# Altium schematic sheet EMP_FC_Main.SchDoc
size A4; SheetNumber: 1; SheetTotal: 5
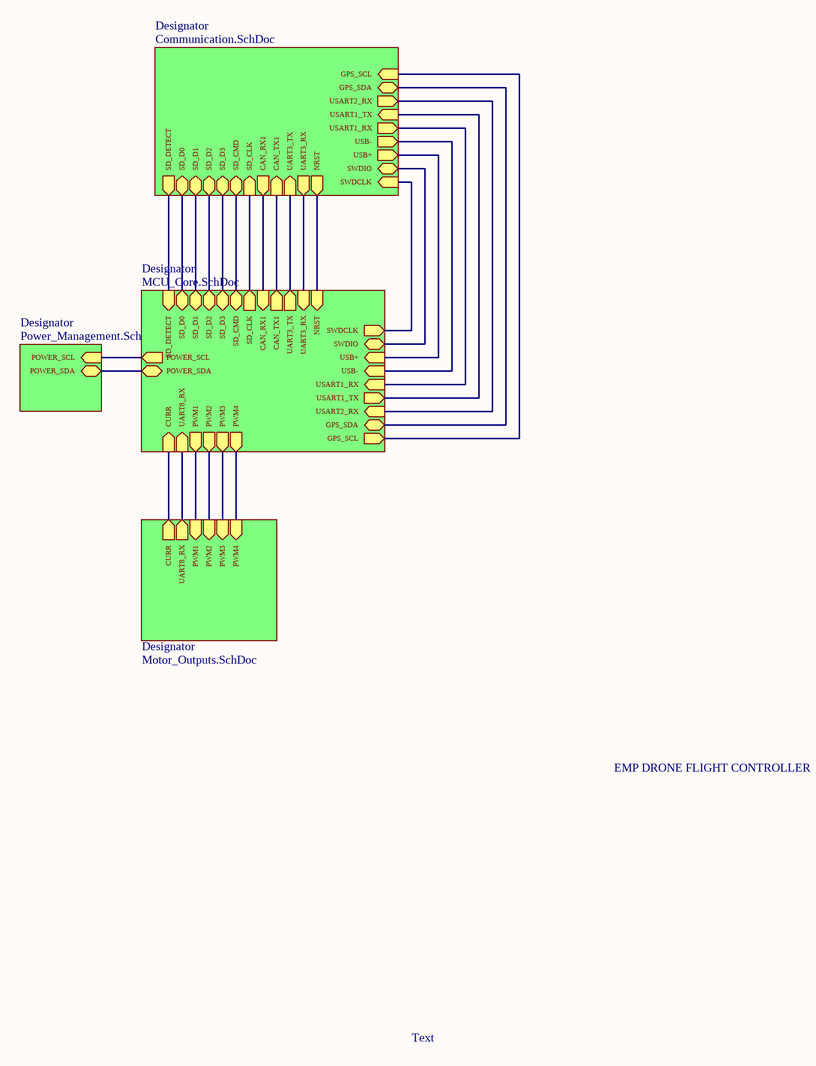
[diagram p0: EMP_FC_Main.SchDoc]

## Sub-sheets
Designator = Power_Management.SchDoc: POWER_SCL (in), POWER_SDA (bidir)
Designator = MCU_Core.SchDoc: PWM4 (out), CURR (in), UART8_RX (in), PWM1 (out), PWM2 (out), PWM3 (out), NRST (in), UART3_RX (in), UART3_TX (out), CAN_TX1 (out), CAN_RX1 (in), SD_CMD (bidir), SD_CLK (out), SD_D3 (bidir), SD_D2 (bidir), SD_D1 (bidir), SD_D0 (bidir), POWER_SCL (out), POWER_SDA (bidir), SWDCLK (out), SWDIO (bidir), USB+ (in), USB- (in), USART1_RX (in), USART1_TX (out), USART2_RX (in), GPS_SDA (bidir), GPS_SCL (out), SD_DETECT (in)
Designator = Communication.SchDoc: SD_D0 (bidir), SD_D1 (bidir), SD_D2 (bidir), SD_D3 (bidir), SD_CMD (bidir), SD_CLK (in), CAN_RX1 (out), CAN_TX1 (in), UART3_TX (in), UART3_RX (out), NRST (out), USART2_RX (out), SWDCLK (in), SWDIO (bidir), USB+ (out), USB- (out), USART1_RX (out), USART1_TX (in), GPS_SDA (bidir), GPS_SCL (in), SD_DETECT (out)
Designator = Motor_Outputs.SchDoc: PWM4 (in), CURR (out), UART8_RX (out), PWM1 (in), PWM2 (in), PWM3 (in)

## Nets
(unnamed): sheet Designator/POWER_SCL, sheet Designator/POWER_SCL
(unnamed): sheet Designator/POWER_SDA, sheet Designator/POWER_SDA
(unnamed): sheet Designator/PWM4, sheet Designator/PWM4
(unnamed): sheet Designator/CURR, sheet Designator/CURR
(unnamed): sheet Designator/UART8_RX, sheet Designator/UART8_RX
(unnamed): sheet Designator/PWM1, sheet Designator/PWM1
(unnamed): sheet Designator/PWM2, sheet Designator/PWM2
(unnamed): sheet Designator/PWM3, sheet Designator/PWM3
(unnamed): sheet Designator/NRST, sheet Designator/NRST
(unnamed): sheet Designator/UART3_RX, sheet Designator/UART3_RX
(unnamed): sheet Designator/UART3_TX, sheet Designator/UART3_TX
(unnamed): sheet Designator/CAN_TX1, sheet Designator/CAN_TX1
(unnamed): sheet Designator/CAN_RX1, sheet Designator/CAN_RX1
(unnamed): sheet Designator/SD_CMD, sheet Designator/SD_CMD
(unnamed): sheet Designator/SD_CLK, sheet Designator/SD_CLK
(unnamed): sheet Designator/SD_D3, sheet Designator/SD_D3
(unnamed): sheet Designator/SD_D2, sheet Designator/SD_D2
(unnamed): sheet Designator/SD_D1, sheet Designator/SD_D1
(unnamed): sheet Designator/SD_D0, sheet Designator/SD_D0
(unnamed): sheet Designator/SWDCLK, sheet Designator/SWDCLK
(unnamed): sheet Designator/SWDIO, sheet Designator/SWDIO
(unnamed): sheet Designator/USB+, sheet Designator/USB+
(unnamed): sheet Designator/USB-, sheet Designator/USB-
(unnamed): sheet Designator/USART1_RX, sheet Designator/USART1_RX
(unnamed): sheet Designator/USART1_TX, sheet Designator/USART1_TX
(unnamed): sheet Designator/USART2_RX, sheet Designator/USART2_RX
(unnamed): sheet Designator/GPS_SDA, sheet Designator/GPS_SDA
(unnamed): sheet Designator/GPS_SCL, sheet Designator/GPS_SCL
(unnamed): sheet Designator/SD_DETECT, sheet Designator/SD_DETECT

## Notes on the sheet
- EMP DRONE FLIGHT CONTROLLER
- Text